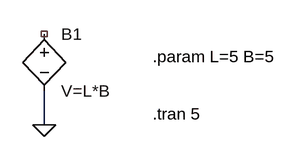
[diagram p0: schematic test_param.asc]
test_param.asc, the LTspice schematic file:
Version 4
SHEET 1 880 680
WIRE 112 256 112 208
FLAG 112 256 0
SYMBOL bv 112 112 R0
SYMATTR InstName B1
SYMATTR Value V=L*B
TEXT 264 160 Left 2 !.param L=5 B=5
TEXT 264 240 Left 2 !.tran 5

The netlist it stands for:
* test_param.asc
B1 NC_01 0 V=L*B
.param L=5 B=5
.tran 5
.backanno
.end